# EAGLE design NeoGeo-JAMMA-Supergun PP (EAGLE 9.6.2)
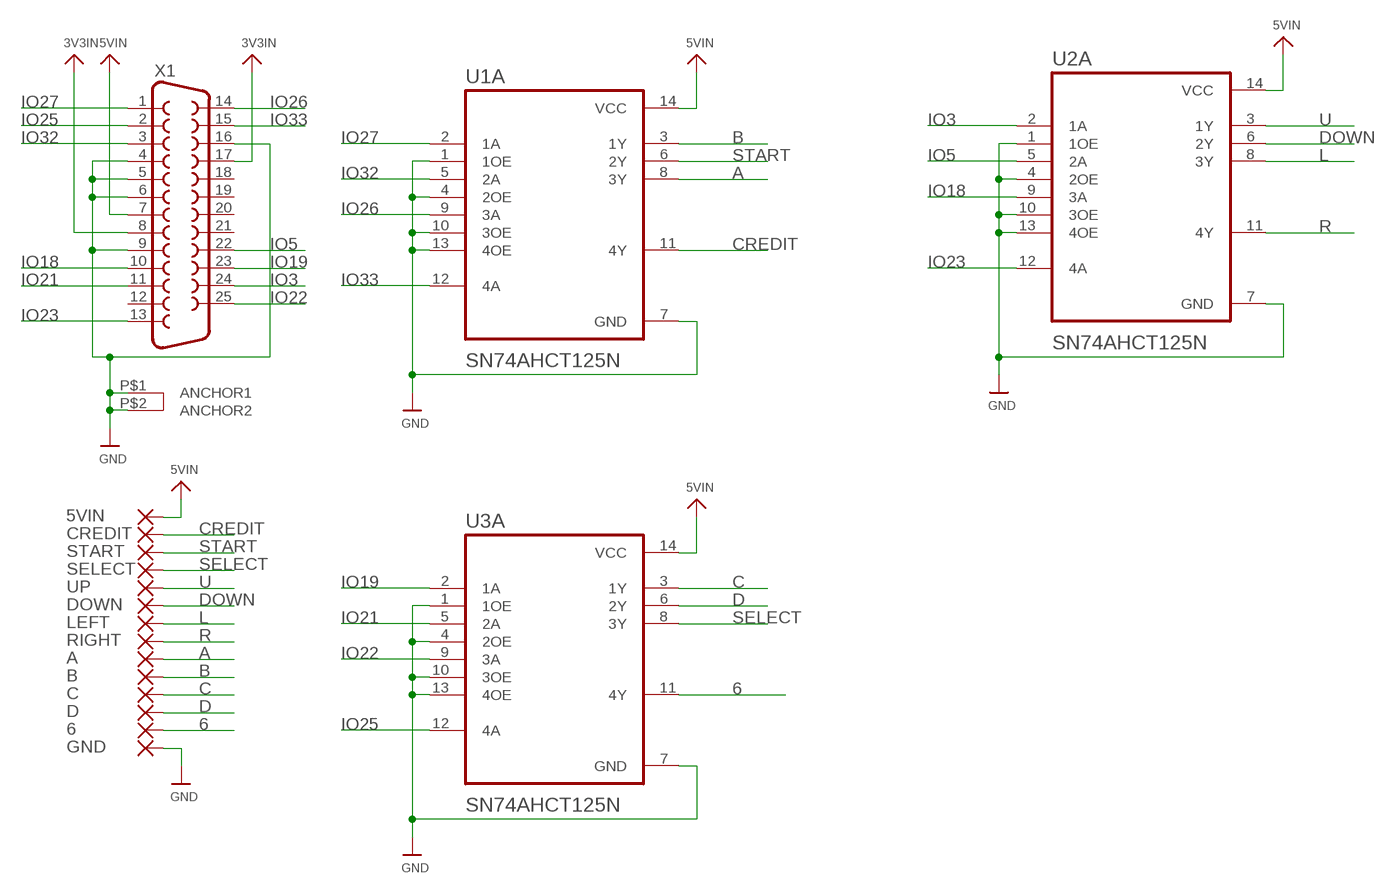
[diagram p0: schematic, sheet 1]

## Parts
5VIN  SMD5  [SMD2,54-5,08]
6  SMD5  [SMD2,54-5,08]
A  SMD5  [SMD2,54-5,08]
B  SMD5  [SMD2,54-5,08]
C  SMD5  [SMD2,54-5,08]
CREDIT  SMD5  [SMD2,54-5,08]
D  SMD5  [SMD2,54-5,08]
DOWN  SMD5  [SMD2,54-5,08]
GND  SMD5  [SMD2,54-5,08]
LEFT  SMD5  [SMD2,54-5,08]
RIGHT  SMD5  [SMD2,54-5,08]
SELECT  SMD5  [SMD2,54-5,08]
START  SMD5  [SMD2,54-5,08]
U1A  SN74AHCT125N  [DIP794W45P254L1969H508Q14]
U2A  SN74AHCT125N  [DIP794W45P254L1969H508Q14]
U3A  SN74AHCT125N  [DIP794W45P254L1969H508Q14]
UP  SMD5  [SMD2,54-5,08]
X1  DB25_FEMALEH  [F25H]

## Nets
3V3IN: X1.8 X1.17
5VIN: 5VIN.1(P) U1A.14(VCC) U2A.14(VCC) U3A.14(VCC) X1.7
6: 6.1(P) U3A.11(4Y)
A: A.1(P) U1A.8(3Y)
B: B.1(P) U1A.3(1Y)
C: C.1(P) U3A.3(1Y)
CREDIT: CREDIT.1(P) U1A.11(4Y)
D: D.1(P) U3A.6(2Y)
DOWN: DOWN.1(P) U2A.6(2Y)
GND: GND.1(P) U1A.1(1OE) U1A.4(2OE) U1A.7(GND) U1A.10(3OE) U1A.13(4OE) U2A.1(1OE) U2A.4(2OE) U2A.7(GND) U2A.10(3OE) U2A.13(4OE) U3A.1(1OE) U3A.4(2OE) U3A.7(GND) U3A.10(3OE) U3A.13(4OE) X1.4 X1.5 X1.6 X1.9 X1.16 X1.P$1(ANCHOR1) X1.P$2(ANCHOR2)
IO3: U2A.2(1A) X1.24
IO5: U2A.5(2A) X1.22
IO18: U2A.9(3A) X1.10
IO19: U3A.2(1A) X1.23
IO21: U3A.5(2A) X1.11
IO22: U3A.9(3A) X1.25
IO23: U2A.12(4A) X1.13
IO25: U3A.12(4A) X1.2
IO26: U1A.9(3A) X1.14
IO27: U1A.2(1A) X1.1
IO32: U1A.5(2A) X1.3
IO33: U1A.12(4A) X1.15
L: LEFT.1(P) U2A.8(3Y)
R: RIGHT.1(P) U2A.11(4Y)
SELECT: SELECT.1(P) U3A.8(3Y)
START: START.1(P) U1A.6(2Y)
U: U2A.3(1Y) UP.1(P)
Unconnected: X1.12 X1.18 X1.19 X1.20 X1.21

## Library data of the parts
5VIN 6 A B C CREDIT D DOWN GND LEFT RIGHT SELECT START UP = wirepad:SMD5: SMD PAD
U1A U2A U3A = SN74AHCT125N:SN74AHCT125N: None Check prices <https://pricing.snapeda.com/parts/SN74AHCT125N/Texas%20Instruments/view-part?ref=eda>; AVAILABILITY: In Stock; DESCRIPTION: Quadruple Bus Buffer Gates With 3-State Outputs 14-PDIP -40 to 125; MF: Texas Instruments; MP: SN74AHCT125N; PACKAGE: PDIP-14 Texas Instruments; PRICE: None; PURCHASE-URL: https://pricing.snapeda.com/search/part/SN74AHCT125N/?ref=eda
X1 = SparkFun-Retired:DB25_FEMALE: 25 Pin male connector. PCB edge mount for regular PCB thicknesses. This connector will connect directly to the back of a PC parallel port or through a normal DB25 extension cable (M/F). SKU: PRT-08287

## Board
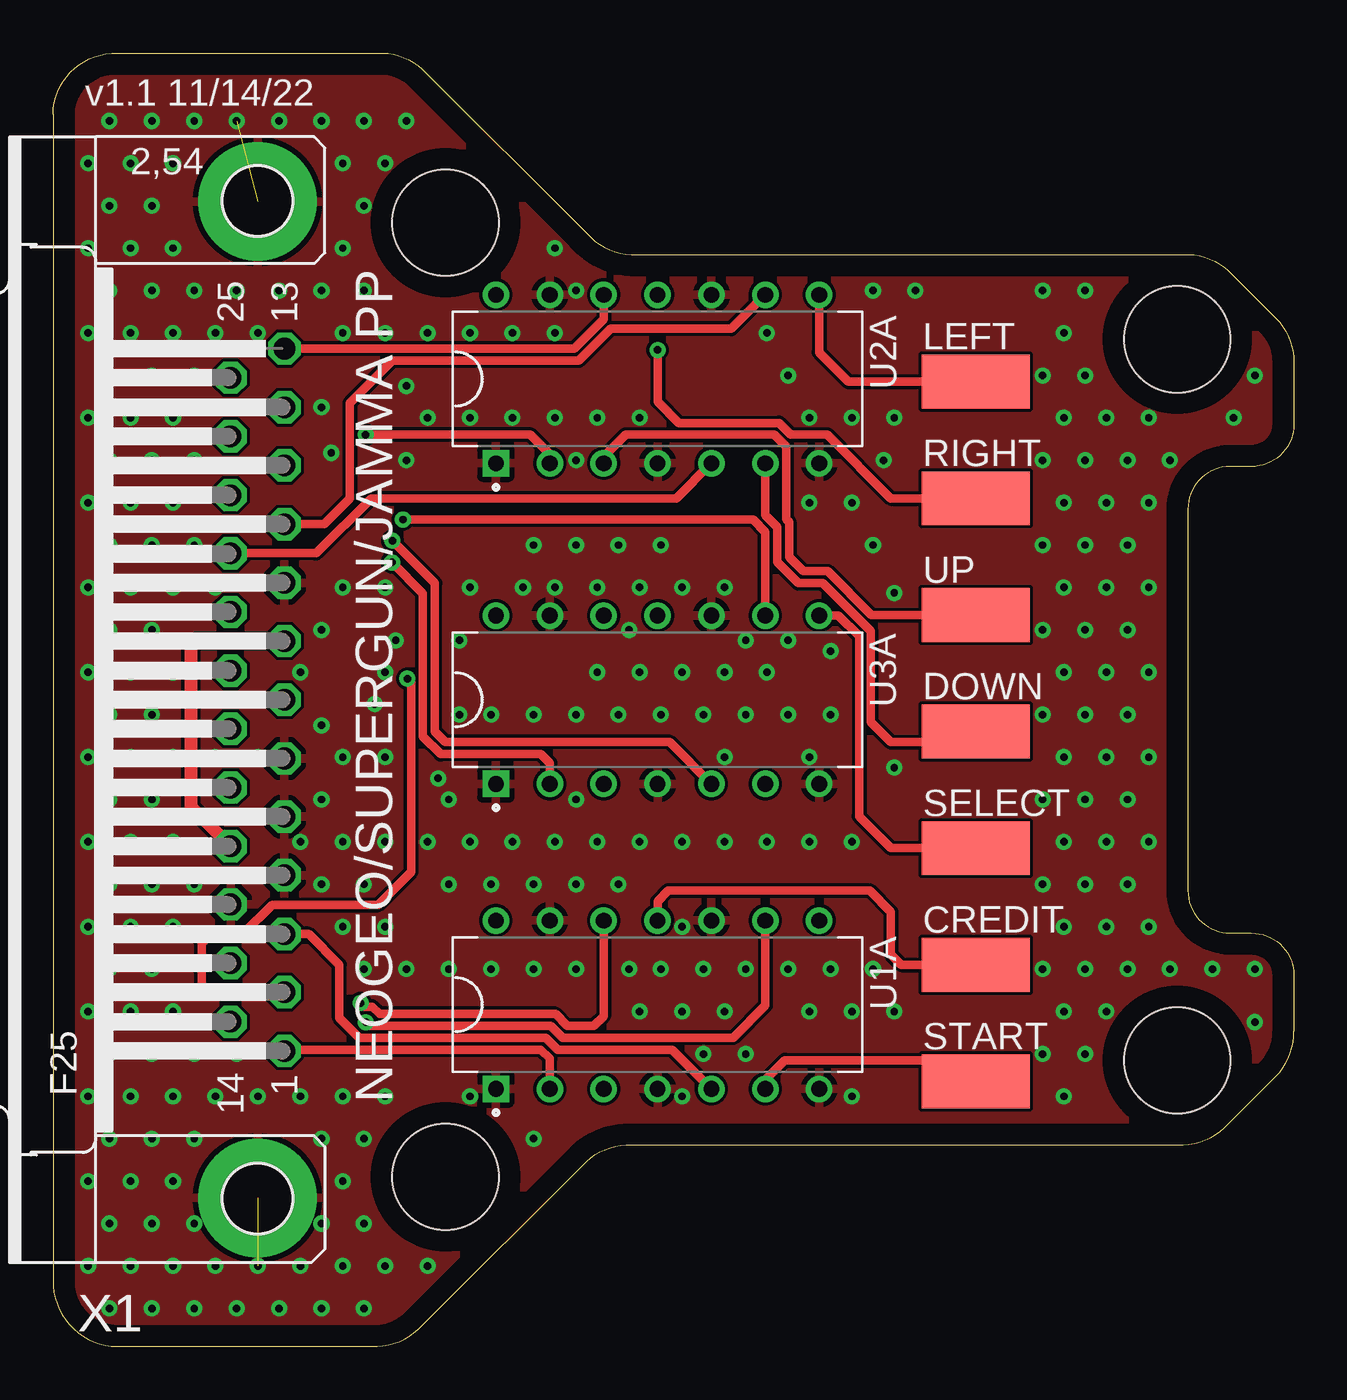
[diagram p1: board, top side]
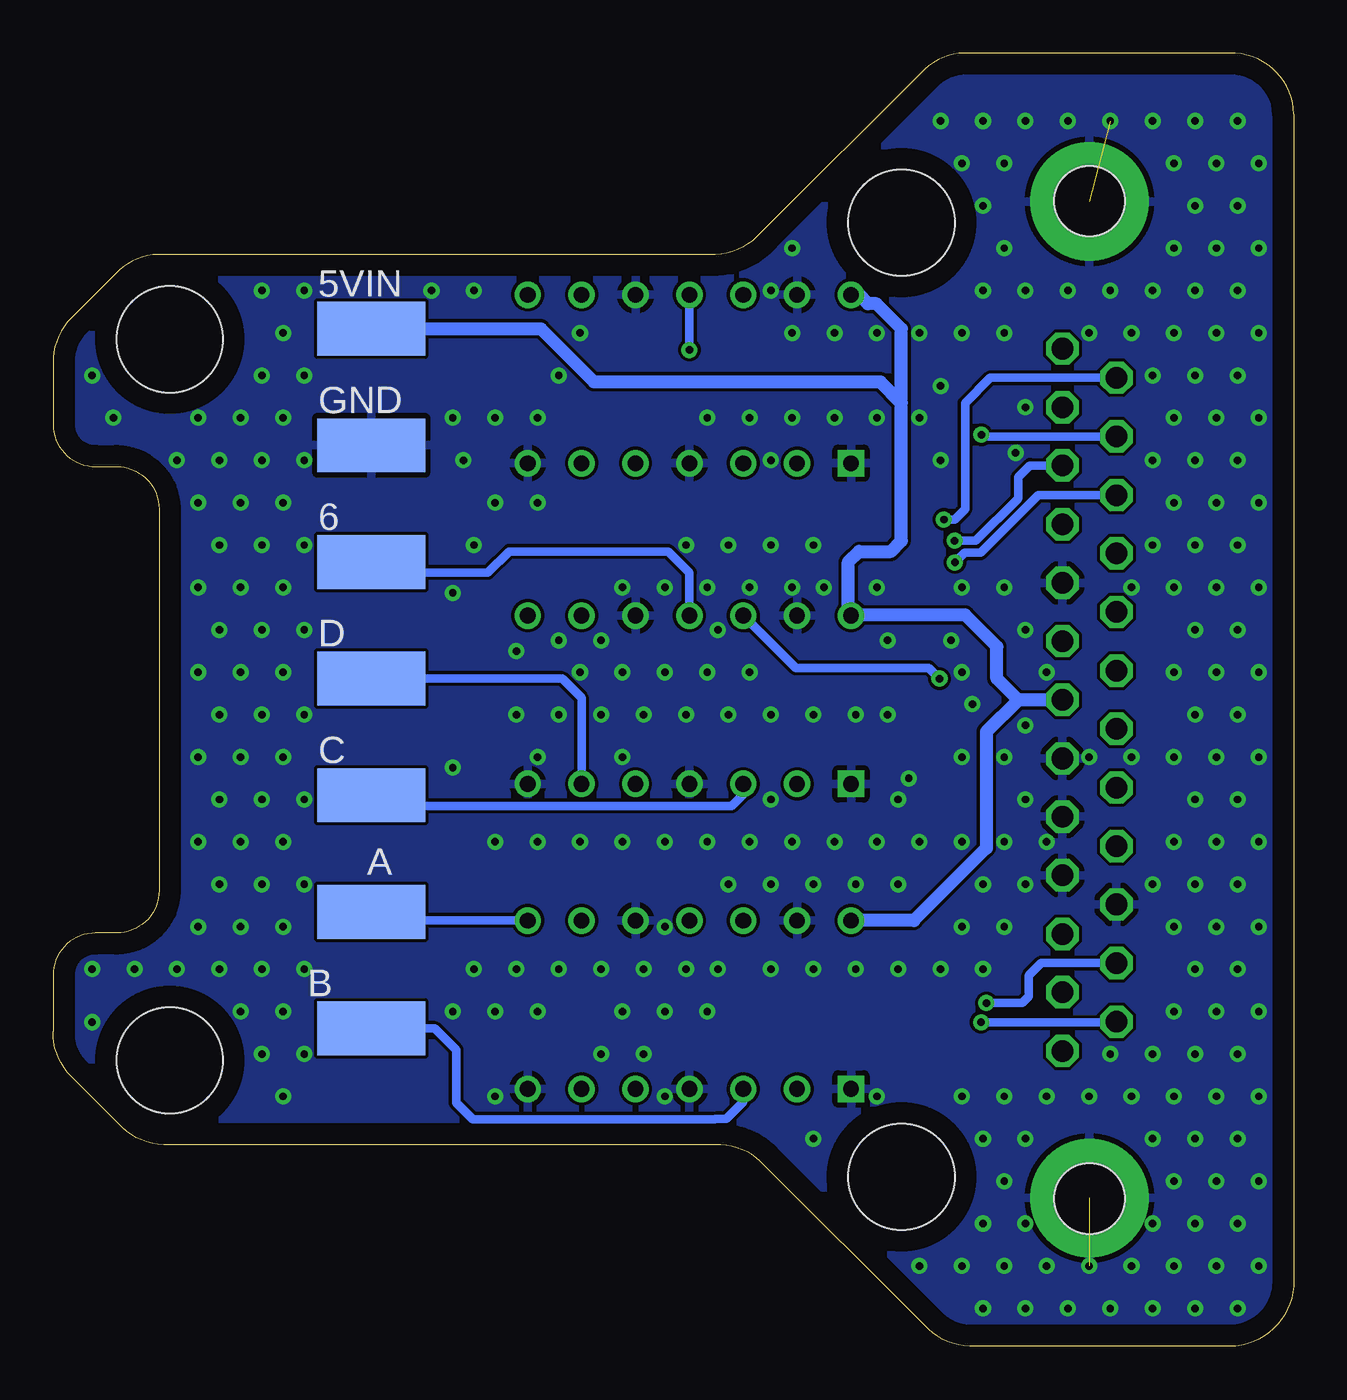
[diagram p2: board, bottom side, seen from below]

Size 58.5 x 61 mm. Coordinates in mm from the lower left corner, seen from the top.
Outline: 0,58.12 0,3.12 arc90 3.03,0 15.29,0 arc45 17.41,1 25.15,8.74 arc-45 27.27,9.5 53.29,9.5 arc45 55.41,10.5 57.65,12.74 arc45 58.5,14.86 58.5,17.5 arc90 56.5,19.5 55.5,19.5 arc-90 53.5,21.5 53.5,39.5 arc-90 55.5,41.5 56.5,41.5 arc90 58.5,43.5 58.5,46.38 arc45 57.65,48.5 55.41,50.74 arc45 53.29,51.5 27.27,51.5 arc-45 25.15,52.5 17.41,60.24 arc45 15.29,61 3.03,61 arc90 0,58.12
Copper layers (1*16): Top 0.035mm / dielectric 1.5mm / Bottom 0.035mm
Design rules "default": minimum track width 6mil, minimum drill 0.35mm, track to track 6mil, track to pad 6mil, pad to pad 6mil, via to via 6mil, smd to smd 6mil, copper to edge 40mil, drill to drill 6mil, minimum pad ring 10mil, minimum via ring 8mil, stop-mask expansion 4mil, vias tented up to drill 0.5mm, thermal gap 10mil
Holes 5 mm at 53,13.5 53,47.5 18.5,53 18.5,8

### Footprints (pad centres in the part's own frame; a part is rotated, then mirrored left to right if it is on the bottom)
SMD2,54-5,08 = smd 2.54 x 5.08: 1 0,0
DIP794W45P254L1969H508Q14 = drill 0.74 pad 1.14 square: 1 -3.97,7.62 | drill 0.74 pad 1.14: 2 -3.97,5.08; 3 -3.97,2.54; 4 -3.97,0; 5 -3.97,-2.54; 6 -3.97,-5.08; 7 -3.97,-7.62; 8 3.97,-7.62; 9 3.97,-5.08; 10 3.97,-2.54; 11 3.97,0; 12 3.97,2.54; 13 3.97,5.08; 14 3.97,7.62
F25H = drill 1.016 octagon: 1 -16.561,-1.27; 2 -13.792,-1.27; 3 -11.049,-1.27; 4 -8.28,-1.27; 5 -5.512,-1.27; 6 -2.769,-1.27; 7 0,-1.27; 8 2.769,-1.27; 9 5.512,-1.27; 10 8.28,-1.27; 11 11.049,-1.27; 12 13.792,-1.27; 13 16.561,-1.27; 14 -15.189,1.27; 15 -12.421,1.27; 16 -9.652,1.27; 17 -6.909,1.27; 18 -4.14,1.27; 19 -1.372,1.27; 20 1.372,1.27; 21 4.14,1.27; 22 6.909,1.27; 23 9.652,1.27; 24 12.421,1.27; 25 15.189,1.27 | drill 3.302 pad 5.588: P$1 -23.495,0; P$2 23.495,0 | hole 3.302: -23.52,0; 23.52,0

### Placement (x,y rotation side)
5VIN  43.5,48 270 bottom
6  43.5,37 270 bottom
A  43.5,20.5 270 bottom
B  43.5,15 270 bottom
C  43.5,26 270 bottom
CREDIT  43.5,18 270 top
D  43.5,31.5 270 bottom
DOWN  43.5,29 270 top
GND  43.5,42.5 270 bottom
LEFT  43.5,45.5 270 top
RIGHT  43.5,40 270 top
SELECT  43.5,23.5 270 top
START  43.5,12.5 270 top
U1A  28.5,16.12 90 top
U2A  28.5,45.63 90 top
U3A  28.5,30.5 90 top
UP  43.5,34.5 270 top
X1  9.64,30.5 90 top

### Tracks (layer width: path | path; a pad name or v marks a point on that pad's centre or on a via)
3V3IN
  Top 0.61: X1.8 6.77,33.27 6.5,33 6.5,25.46 X1.17
5VIN
  Bottom 0.61: X1.7 13,30.5 | 13,30.5 14,31.5 14,33 15.5,34.5 20.85,34.5 U3A.14 21,34.59 21,37 20.5,37.5 19,37.5 18.5,38 18.5,44.5 | 18.5,44.5 18.5,48 19.68,49.18 20.08,49.18 20.5,49.6 U2A.14 | U1A.14 17.91,20.09 14.5,23.5 14.5,29 13,30.5 | 5VIN.1 35.5,48 33,45.5 19.5,45.5 18.5,44.5
6
  Bottom 0.406: U3A.11 28.5,36.5 29.5,37.5 37,37.5 38,36.5 43,36.5 6.1
A
  Bottom 0.406: U1A.8 43.09,20.09 A.1
B
  Bottom 0.406: U1A.3 25.96,11.54 26.77,10.73 27.29,10.73 27.3,10.72 38.72,10.72 39.5,11.5 39.5,14 40.5,15 B.1
C
  Bottom 0.406: U3A.3 25.96,26.04 26.5,25.5 43,25.5 C.1
CREDIT
  Top 0.406: U1A.11 28.5,21 29,21.5 38.5,21.5 39.5,20.5 39.5,18.5 40,18 CREDIT.1
D
  Bottom 0.406: U3A.6 33.58,30.58 34.5,31.5 D.1
DOWN
  Top 0.406: U2A.6 33.58,39.21 34.14,38.65 34.14,37 35.14,36 36.29,36 38.56,33.73 38.56,29.44 39.5,28.5 43,28.5 DOWN.1
GND  (via drill 0.35)  (2 unrouted)
  other vias: 2.66,1.8 1.66,3.8 2.66,5.8 1.66,7.8 2.66,9.8 1.66,11.8 2.66,13.8 1.66,15.8 2.66,17.8 1.66,19.8 2.66,21.8 1.66,23.8 2.66,25.8 1.66,27.8 2.66,29.8 1.66,31.8 2.66,33.8 1.66,35.8 2.66,37.8 1.66,39.8 2.66,41.8 1.66,43.8 2.66,45.8 1.66,47.8 2.66,49.8 1.66,51.8 2.66,53.8 1.66,55.8 2.66,57.8 4.66,1.8 3.66,3.8 4.66,5.8 3.66,7.8 4.66,9.8 3.66,11.8 4.66,13.8 3.66,15.8 4.66,17.8 3.66,19.8 4.66,21.8 3.66,23.8 4.66,25.8 3.66,27.8 4.66,29.8 3.66,31.8 4.66,33.8 3.66,35.8 4.66,37.8 3.66,39.8 4.66,41.8 3.66,43.8 4.66,45.8 3.66,47.8 4.66,49.8 3.66,51.8 4.66,53.8 3.66,55.8 4.66,57.8 6.66,1.8 5.66,3.8 6.66,5.8 5.66,7.8 6.66,9.8 5.66,11.8 6.66,13.8 5.66,15.8 5.66,19.8 6.66,21.8 5.66,23.8 5.66,27.8 5.66,31.8 5.66,35.8 6.66,37.8 5.66,39.8 6.66,41.8 5.66,43.8 6.66,45.8 5.66,47.8 6.66,49.8 5.66,51.8 5.66,55.8 6.66,57.8 8.66,1.8 7.66,3.8 7.66,11.8 8.66,13.8 7.66,27.8 7.66,35.8 13.12,42.15 7.66,47.8 8.66,49.8 8.66,57.8 10.66,1.8 9.66,3.8 9.66,11.8 9.66,27.8 9.66,47.8 10.66,49.8 10.66,57.8 12.66,1.8 11.66,3.8 12.66,5.8 12.66,9.8 11.66,11.8 12.66,21.8 11.66,23.8 12.66,25.8 12.66,29.3 11.66,31.8 12.66,33.8 12.66,44.3 12.66,49.8 12.66,57.8 14.66,1.8 13.66,3.8 14.66,5.8 13.66,7.8 14.66,9.8 13.66,11.8 14.66,17.8 13.66,19.8 14.66,21.8 13.66,23.8 13.66,27.8 15.16,30.3 13.66,35.8 13.66,47.8 14.66,49.8 13.66,51.8 14.66,53.8 13.66,55.8 14.66,57.8 15.66,3.8 15.66,11.8 16.66,17.8 15.66,19.8 15.66,23.8 15.66,27.8 15.66,31.8 16.16,33.3 15.66,35.8 16.66,41.8 16.66,45.3 15.66,47.8 15.66,55.8 16.66,57.8 17.66,3.8 18.66,17.8 18.66,21.8 17.66,23.8 18.66,25.8 18.16,26.8 19.16,29.8 19.16,33.3 17.66,43.8 17.66,47.8 19.66,11.8 20.66,17.8 20.66,21.8 19.66,23.8 20.66,29.8 19.66,35.8 19.66,43.8 19.66,47.8 22.66,9.8 22.66,17.8 22.66,21.8 21.66,23.8 22.66,29.8 22.16,35.8 22.66,37.8 21.66,43.8 21.66,47.8 24.66,17.8 24.66,21.8 23.66,23.8 24.66,25.8 24.66,29.8 23.66,35.8 24.66,37.8 24.66,41.8 23.66,43.8 23.66,47.8 24.66,49.8 23.66,51.8 27.16,17.8 26.66,21.8 25.66,23.8 26.66,29.8 25.66,31.8 27.16,33.8 25.66,35.8 26.66,37.8 25.66,43.8 27.66,15.8 28.66,17.8 27.66,23.8 28.66,29.8 27.66,31.8 27.66,35.8 28.66,37.8 27.66,43.8 29.66,11.8 30.66,13.8 29.66,15.8 30.66,17.8 29.66,19.8 29.66,23.8 30.66,29.8 29.66,31.8 29.66,35.8 32.66,13.8 31.66,15.8 32.66,17.8 31.66,23.8 31.66,27.8 32.66,29.8 31.66,31.8 32.66,33.3 31.66,35.8 34.66,17.8 33.66,23.8 34.66,29.8 33.66,31.8 34.66,33.3 34.66,45.8 33.66,47.8 35.66,15.8 36.66,17.8 35.66,23.8 35.66,27.8 36.66,29.8 36.66,32.8 35.66,39.8 35.66,43.8 37.66,11.8 37.66,15.8 38.66,17.8 37.66,23.8 38.66,37.8 37.66,39.8 39.16,41.8 37.66,43.8 38.66,49.8 39.66,15.8 39.66,27.3 39.66,35.54 39.66,43.8 40.66,49.8 46.66,13.8 46.66,17.8 46.66,21.8 46.66,25.8 46.66,29.8 46.66,33.8 46.66,37.8 46.66,41.8 46.66,45.8 46.66,49.8 47.66,11.8 48.66,13.8 47.66,15.8 48.66,17.8 47.66,19.8 48.66,21.8 47.66,23.8 48.66,25.8 47.66,27.8 48.66,29.8 47.66,31.8 48.66,33.8 47.66,35.8 48.66,37.8 47.66,39.8 48.66,41.8 47.66,43.8 48.66,45.8 47.66,47.8 48.66,49.8 49.66,15.8 50.66,17.8 49.66,19.8 50.66,21.8 49.66,23.8 50.66,25.8 49.66,27.8 50.66,29.8 49.66,31.8 50.66,33.8 49.66,35.8 50.66,37.8 49.66,39.8 50.66,41.8 49.66,43.8 52.66,17.8 51.66,19.8 51.66,23.8 51.66,27.8 51.66,31.8 51.66,35.8 51.66,39.8 52.66,41.8 51.66,43.8 54.66,17.8 56.66,15.3 56.66,17.8 55.66,43.8 56.66,45.8
  pour Bottom: 0,0 0,61.12 28.53,61.12 28.53,51.62 59.03,51.62 59.03,9.5 28.03,9.5 28.03,0
  pour Top: 0,0 0,61.12 28.53,61.12 28.53,51.62 59.03,51.62 59.03,9.5 28.03,9.5 28.03,0
IO3  (via drill 0.35)
  Top 0.406: U2A.2 23.42,42.08 22.5,43 v14.73,43
  Bottom 0.406: v14.73,43 14.65,42.92 X1.24
IO5
  Top 0.406: U2A.5 29.38,40 15,40 12.41,37.41 X1.22
IO18
  Top 0.406: U2A.9 31.98,48 26.29,48 24.79,46.5 20,46.5 16,46.5 14,44.5 14,40 12.78,38.78 X1.10
IO19  (via drill 0.35)
  Top 0.406: U3A.2 23.42,27.52 23,27.94 18.27,27.94 17.44,28.77 17.44,35.52 v15.98,36.98
  Bottom 0.406: v15.98,36.98 15.52,37.44 14.77,37.44 12.06,40.15 X1.23
IO21  (via drill 0.35)
  Top 0.406: U3A.5 29.07,28.5 18.5,28.5 18,29 18,36 v16,38
  Bottom 0.406: v16,38 15,38 13,40 13,41 12.45,41.55 X1.11
IO22  (via drill 0.35)
  Top 0.406: U3A.9 33.58,38.42 33,39 v16.5,39
  Bottom 0.406: v16.5,39 16,39 15.5,39.5 15.5,44.5 14.31,45.69 X1.25
IO23
  Top 0.406: U2A.12 25.96,48.46 24.56,47.06 X1.13
IO25  (via drill 0.35)
  Top 0.406: X1.2 7.29,16.71 7,17 7,19 7.5,19.5 9,19.5 10.33,20.83 15.33,20.83 16.88,22.38 16.88,31.32 v16.71,31.5
  Bottom 0.406: v16.71,31.5 17.21,32 23.49,32 U3A.12
IO26  (via drill 0.35)
  Top 0.406: U1A.9 33.58,16.08 32.06,14.56 24.02,14.56 23.46,15.12 14.92,15.12 v14.74,15.29
  Bottom 0.406: v14.74,15.29 8.39,15.29 X1.14
IO27
  Top 0.406: U1A.2 23.42,13.58 23,14 10.97,14 X1.1
IO32
  Top 0.406: U1A.5 29.19,14 23.79,14 23.23,14.56 14.44,14.56 13.5,15.5 13.5,18 12.05,19.45 X1.3
IO33  (via drill 0.35)
  Top 0.406: U1A.12 25.96,15.58 25.5,15.12 24.25,15.12 23.69,15.68 15.4,15.68 15.05,16.03 14.68,16.03 v14.5,16.2
  Bottom 0.406: v14.5,16.2 12.8,16.2 12.5,16.5 12.5,17.5 11.92,18.08 X1.15
L
  Top 0.406: U2A.8 36.12,46.88 37.5,45.5 LEFT.1
R  (via drill 0.35)
  Top 0.406: RIGHT.1 39.5,40 36.5,43 34.79,43 34.23,43.56 29.5,43.56 28.5,44.56 v28.5,47
  Bottom 0.406: U2A.11 v28.5,47
SELECT
  Top 0.406: U3A.8 37.03,34.47 38,33.5 38,25 39.5,23.5 SELECT.1
START
  Top 0.406: U1A.6 33.58,12.58 34.5,13.5 42,13.5 43,12.5 START.1
U
  Top 0.406: U2A.3 25.96,41.96 27,43 34,43 34.56,42.44 34.56,39.02 34.7,38.88 34.7,37.23 35.37,36.56 36.52,36.56 38.58,34.5 UP.1

### Text on the board
tPlace: v1.1 11/14/22 | NEOGEO/SUPERGUN/JAMMA PP